# Altium schematic sheet hardware.SchDoc
size 431 x 279 mm; Date: Not shown in title block; ApprovedBy: Not shown in title block; CheckedBy: Not shown in title block; Author: Not shown in title block; CompanyName: Not shown in title block; Engineer: Not shown in title block; Organization: Not shown in title block; Address1: Not shown in title block; Address2: Not shown in title block; Address3: Not shown in title block; Address4: Not shown in title block; DocumentNumber: 3; Revision: Use project parameter SCH_Rev; SheetNumber: 3; SheetTotal: 3; PageSetup: Record=PageOptions|CenterHorizontal=True|CenterVertical=True|PrintScale=1.00|XCorrection=1.00|YCorrection=1.00|PrintKind=0|BorderSize=5000000|LeftOffset=0|BottomOffset=0|Orientation=2|PaperLength=1000|PaperWidth=1000|Scale=100|PaperSource=15|PrintQuality=600|MediaType=1|DitherType=10|PaperKind=Letter|PrintScaleMode=1; CurrentTime: Not shown in title block; CurrentDate: Not shown in title block; Time: Not shown in title block; DocumentFullPathAndName: Not shown in title block; DocumentName: Not shown in title block; ModifiedDate: Not shown in title block; ImagePath: Not shown in title block
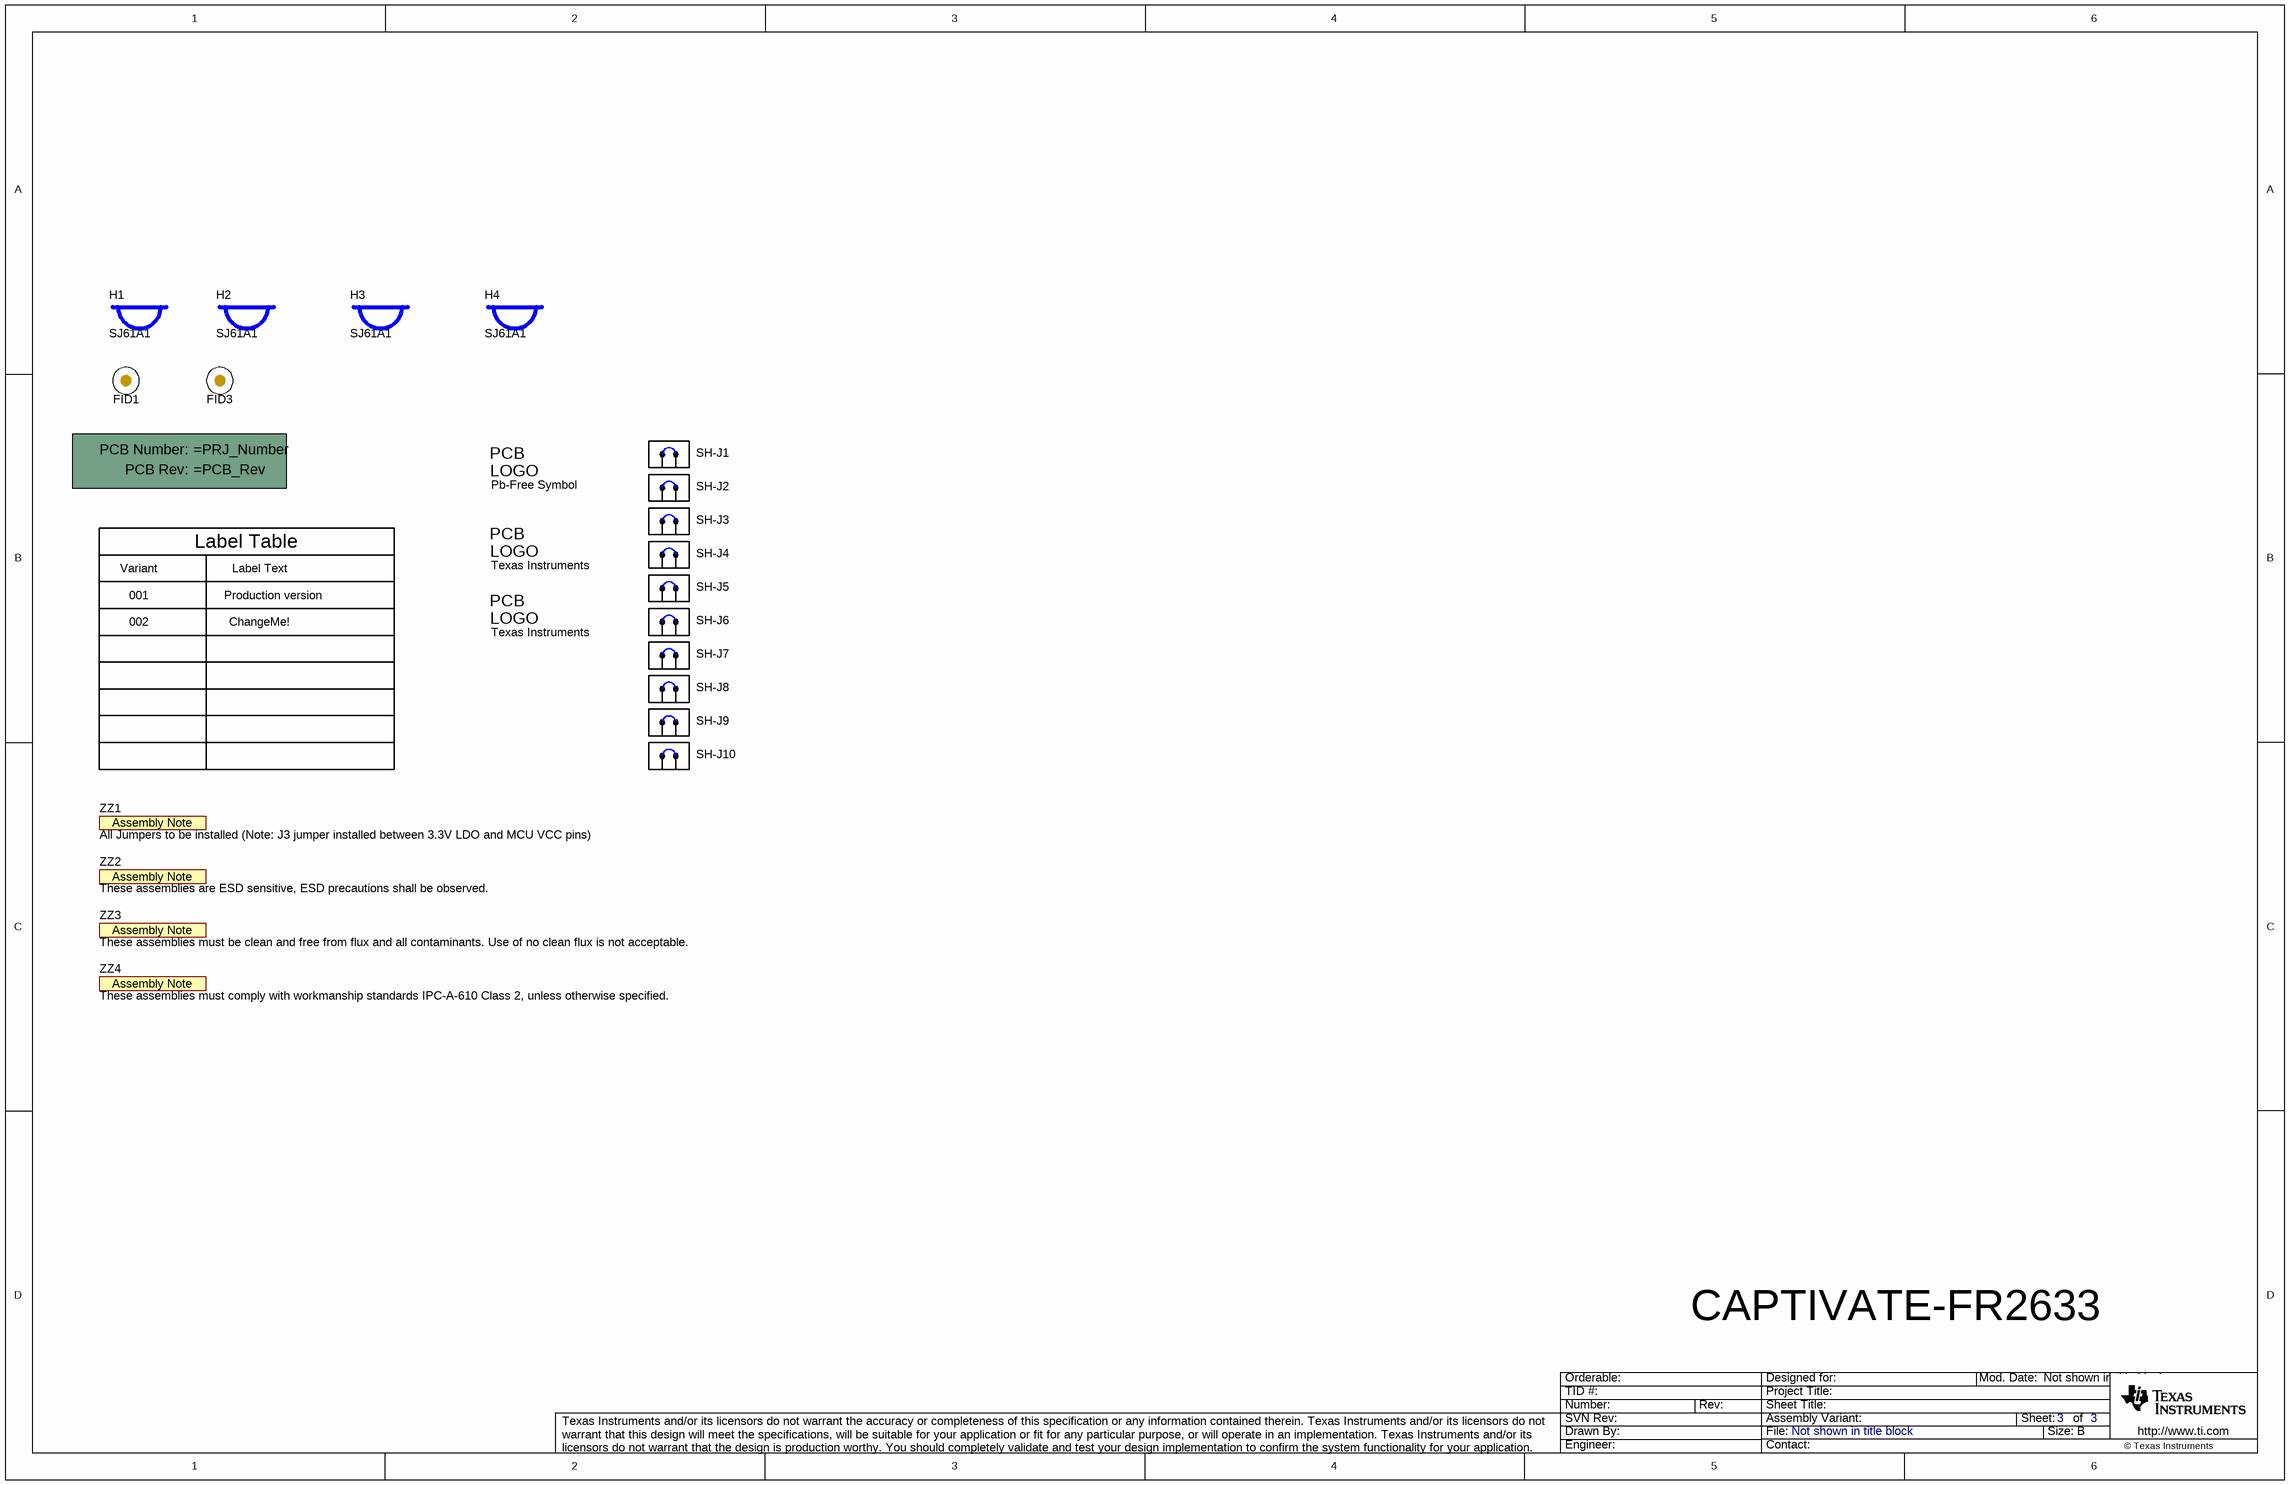
[diagram p0: hardware.SchDoc]

## Parts
!PCB1  Printed Circuit Board  (value not drawn)  (mechanical)
FID1  Fiducial  [Fiducial10-20]  (value not drawn)
FID3  Fiducial  [Fiducial10-20]  (value not drawn)
H1  SJ61A1  [Bumpon_SJ61A1]
H2  SJ61A1  [Bumpon_SJ61A1]
H3  SJ61A1  [Bumpon_SJ61A1]
H4  SJ61A1  [Bumpon_SJ61A1]
Logo1  Pb-Free Symbol  [Pb-Free_Overlay_Small]  (no BOM)
Logo2  Texas Instruments  [TI_Symbol_Overlay_Small]  (no BOM)
Logo3  Texas Instruments  [TI_Stacked_Overlay_Small]  (no BOM)
SH-J1  SPC02SYAN  [SPC02SYAN]  (value not drawn)
SH-J2  SPC02SYAN  [SPC02SYAN]  (value not drawn)
SH-J3  SPC02SYAN  [SPC02SYAN]  (value not drawn)
SH-J4  SPC02SYAN  [SPC02SYAN]  (value not drawn)
SH-J5  SPC02SYAN  [SPC02SYAN]  (value not drawn)
SH-J6  SPC02SYAN  [SPC02SYAN]  (value not drawn)
SH-J7  SPC02SYAN  [SPC02SYAN]  (value not drawn)
SH-J8  SPC02SYAN  [SPC02SYAN]  (value not drawn)
SH-J9  SPC02SYAN  [SPC02SYAN]  (value not drawn)
SH-J10  SPC02SYAN  [SPC02SYAN]  (value not drawn)
ZZ1  All Jumpers to be installed (Note: J3 jumper installed between 3.3V LDO and MCU VCC pins)  [AssemblyNote]  (no BOM)
ZZ2  These assemblies are ESD sensitive, ESD precautions shall be observed.  [AssemblyNote]  (no BOM)
ZZ3  These assemblies must be clean and free from flux and all contaminants. Use of no clean flux is not acceptable.  [AssemblyNote]  (no BOM)
ZZ4  These assemblies must comply with workmanship standards IPC-A-610 Class 2, unless otherwise specified.  [AssemblyNote]  (no BOM)

## Notes on the sheet
- Variant
- Label Table
- Label Text
- 001
- 002
- ChangeMe!
- Production version
- CAPTIVATE-FR2633
- Drawn By:
- SVN Rev:
- Number:
- TID #:
- Orderable:
- Rev:
- Sheet Title:
- File:
- Project Title:
- Designed for:
- Assembly Variant:
- Mod. Date:
- Sheet:
- Size:
- of
- B
- http://www.ti.com
- Texas Instruments and/or its licensors do not warrant the accuracy or completeness of this specification or any information contained therein. Texas Instruments and/or its licensors do not warrant that this design will meet the specifications, will be suitable for your application or fit for any particular purpose, or will operate in an implementation. Texas Instruments and/or its licensors do not warrant that the design is production worthy. You should completely validate and test your design implementation to confirm the system functionality for your application.
- Engineer:
- Contact:
- © Texas Instruments
- (in symbol AssemblyNote) Assembly Note
- (in symbol Pb-Free) PCB; LOGO
- (in symbol PCB) PCB Number:; PCB Rev:
- (in symbol TI_Logo) PCB; LOGO

## Library data of the parts
!PCB1 = PCB: Manufacturer: Any; SymbolCreator: a0412235; SymbolVersion: 2012-05-30; CompType: PCB; PartNumber: =PRJ_Number; RoHS: O; MountType: N/A; Publisher: Texas Instruments; LatestRevisionDate: 2012-06-27; LatestRevisionNote: Initial Version; Alternate Manufacturer: -; Alternate PartNumber: -
FID1 FID3 = Fiducial: Fiducial mark.  There is nothing to buy or mount.; SymbolCreator: codlsc; SymbolVersion: 2009-11-4; CompType: Fiducial; Publisher: Texas Instruments; LatestRevisionDate: 2014-08-01; LatestRevisionNote: Added Alternate PartNumber and Alternate Manufacturer parameters to appropriate components.; Manufacturer: N/A; MountType: N/A; PackageReference: Fiducial; PartNumber: N/A; ClassName: FiducialMark
H1-H4 = SJ61A1: Bumpon, Cylindrical, 0.312 X 0.200, Black; Manufacturer: 3M; SymbolCreator: a0412235; SymbolVersion: 2012-03-04; CompType: Bumpon; PartNumber: SJ61A1; RoHS: Y; PackageReference: Black Bumpon; MountType: N/A; ComponentLink1Description: Datasheet Link; ComponentLink1URL: http://multimedia.3m.com/mws/mediawebserver?mwsId=66666UF6EVsSyXTtOxTXoxMtEVtQEVs6EVs6EVs6E666666--&fn=SJxxA1.pdf; Publisher: Texas Instruments; LatestRevisionDate: 2014-11-19; Supplier 1: Digi-Key; Supplier Part Number 1: SJ5746-0-ND; Supplier 2: Mouser; Supplier Part Number 2: 517-SJ-61A1
Logo1 = Pb-Free: SymbolCreator: a0412235; SymbolVersion: 2011-08-22; Published: 2009-03-03; Publisher: Texas Instruments; LatestRevisionDate: 2014-08-05
Logo2 Logo3 = TI_Logo: Texas Instrument Corporate Signature; SymbolCreator: a0412235; SymbolVersion: 2011-08-22; ClassName: Logo; Published: 2009-03-03; Publisher: Texas Instruments; LatestRevisionDate: 2014-11-20
SH-J1-SH-J10 = SPC02SYAN: Shunt, 100mil, Flash Gold, Black; Manufacturer: Sullins Connector Solutions; Value: 1x2; Note: You can "mate" this to a header by matching the designator.  i.e. use SH-J3 for header J3; ClassName: Shunt; CompType: Shunt; PartNumber: SPC02SYAN; RoHS: Y; PackageReference: Closed Top 100mil Shunt; MountType: N/A; ComponentLink1Description: Datasheet Link; ComponentLink1URL: http://www.sullinscorp.com/drawings/134_C02SYAN_11134.pdf; Publisher: Texas Instruments; LatestRevisionDate: 2014-11-19; Supplier 1: Digi-Key; Supplier Part Number 1: S9001-ND
ZZ1-ZZ4 = AssemblyNote: SymbolCreator: codlsc; SymbolVersion: 2010-05-18; CompType: AssemblyNote; ClassName: AssemblyNote; Publisher: Texas Instruments; LatestRevisionDate: 2012-06-14; LatestRevisionNote: Initial Version; Alternate Manufacturer: -; Alternate PartNumber: -